# EAGLE design Mircrocontroller-test-moudle (EAGLE 8.6.0)
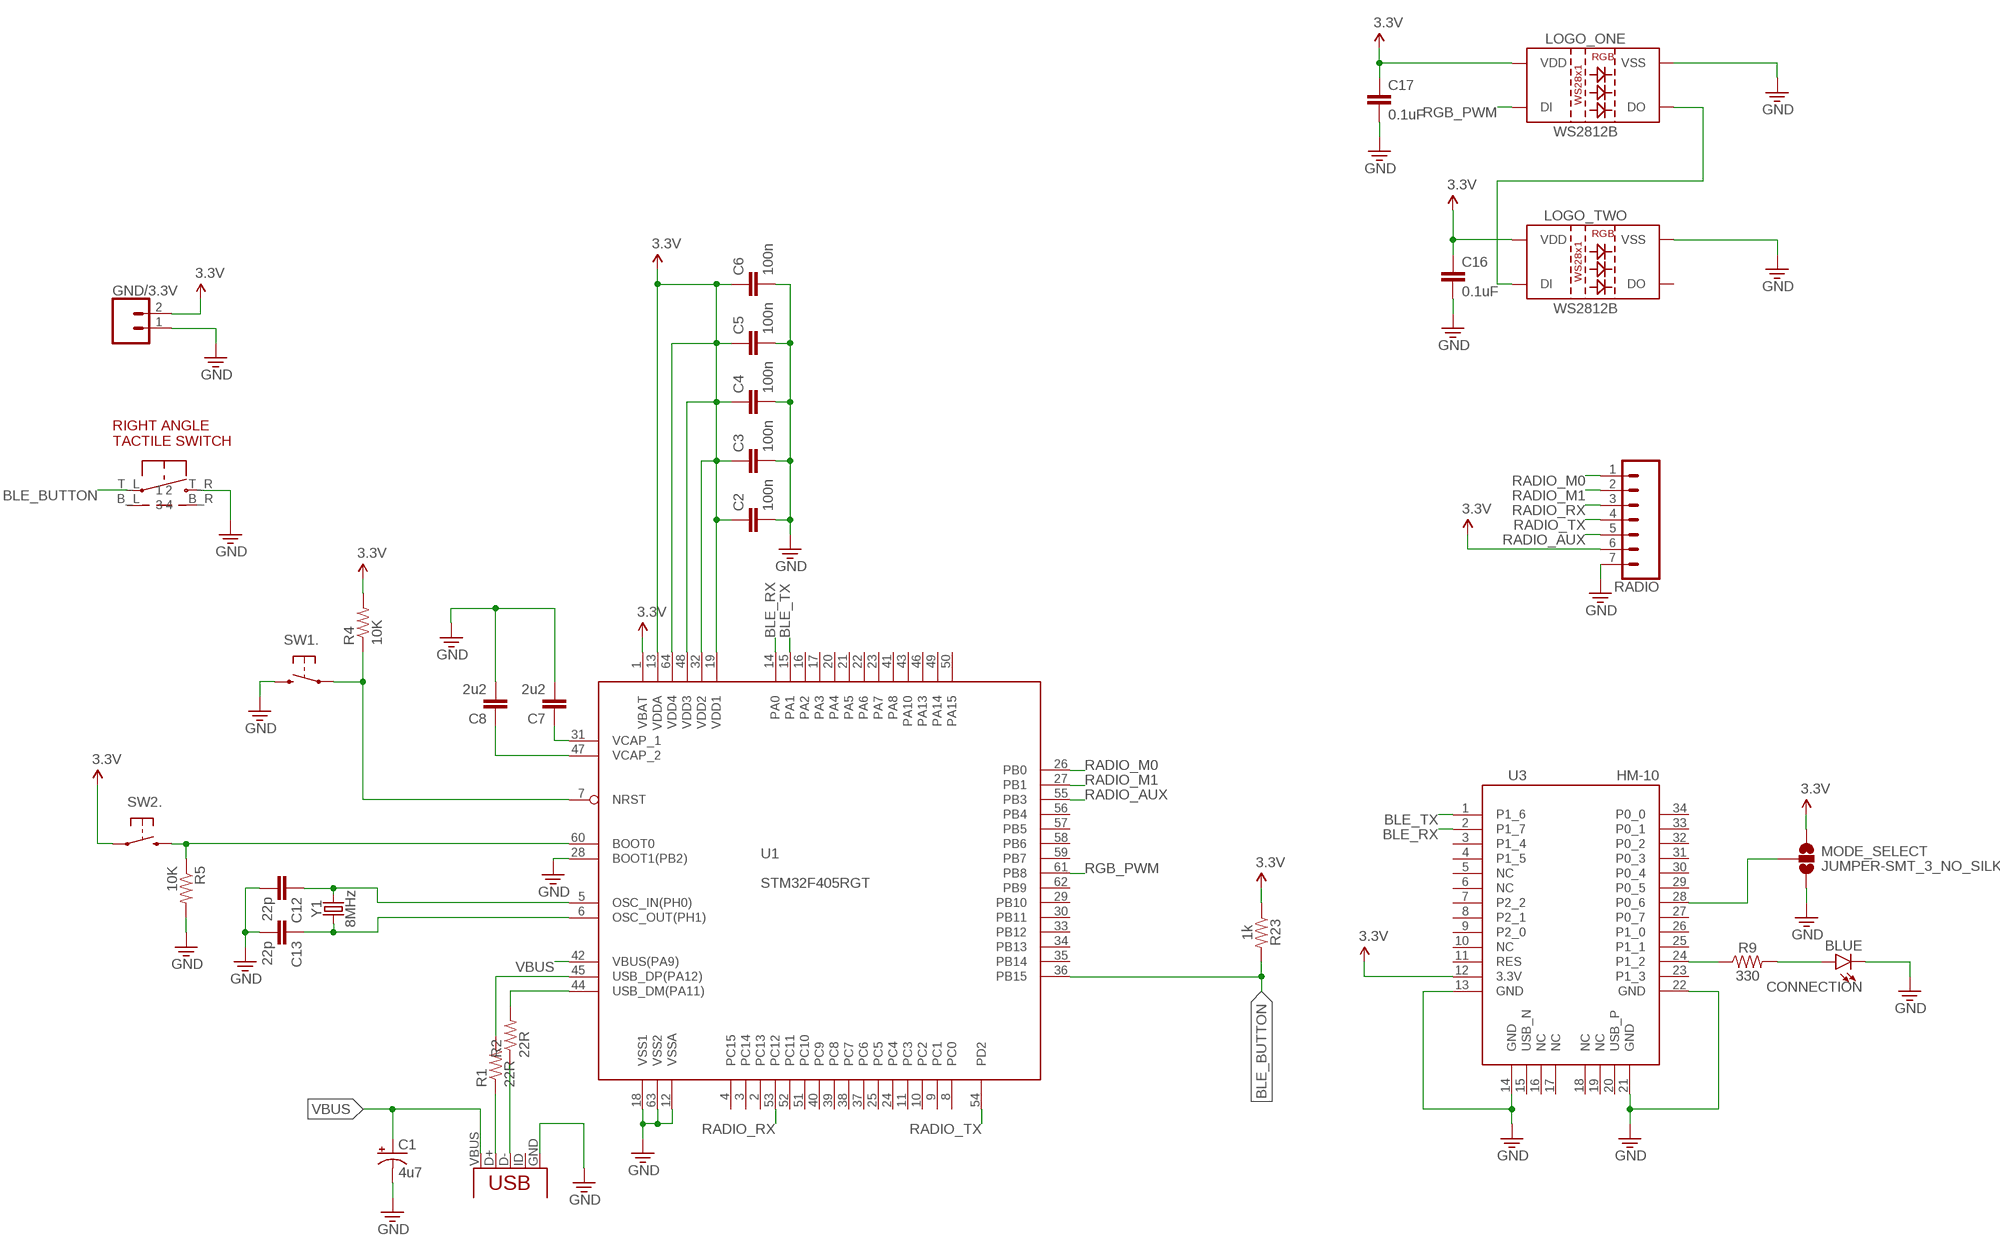
[diagram p0: schematic, sheet 1]

## Parts
C1  4u7  CAP_POL1206-KIT  [EIA3216-KIT]
C2  100n  CAP0603-CAP  [0603-CAP]
C3  100n  CAP0603-CAP  [0603-CAP]
C4  100n  CAP0603-CAP  [0603-CAP]
C5  100n  CAP0603-CAP  [0603-CAP]
C6  100n  CAP0603-CAP  [0603-CAP]
C7  2u2  CAP0603-CAP  [0603-CAP]
C8  2u2  CAP0603-CAP  [0603-CAP]
C12  22p  CAP0603-CAP  [0603-CAP]
C13  22p  CAP0603-CAP  [0603-CAP]
C16  0.1uF  0.1UF-0603-25V-5%  [0603]
C17  0.1uF  0.1UF-0603-25V-5%  [0603]
CONNECTION  BLUE  LED-BLUE0603  [LED-0603]
GND/3.3V  CONN_02LOCK  [1X02_LOCK]
LOGO_ONE  WS2812B  [WS2812B]
LOGO_TWO  WS2812B  [WS2812B]
MODE_SELECT  JUMPER-SMT_3_NO_SILK  [SMT-JUMPER_3_NO_SILK]
R1  22R  RESISTOR0603-RES  [0603-RES]
R2  22R  RESISTOR0603-RES  [0603-RES]
R4  10K  RESISTOR0603-RES  [0603-RES]
R5  10K  RESISTOR0603-RES  [0603-RES]
R9  330  330OHM-0603-1/10W-1%  [0603]
R23  1k  1KOHM-0603-1/10W-1%  [0603]
RADIO  CONN_07  [1X07]
SW1  !RST  SWITCH-B3U-1110-BOSS  [SWITCH-TACT-B3U-1100P-B]
SW2  BOOT  SWITCH-B3U-1110-BOSS  [SWITCH-TACT-B3U-1100P-B]
U1  STM32F405RGT  [LQFP64]
U3  HM-10  [HM-10]
U$1  RIGHT_ANGLE_TACTILE_SWITCH  [RIGHT_ANGLE_TACTILE_SWITCH]
USB  USB-MICROB-SMD  [USB-MICROB-SMD]
Y1  8MHz  CRYSTAL-8MHZSMD-5X3.2  [CRYSTAL-SMD-5X3.2-4PAD]

## Nets
3.3V: C2.1 C3.1 C4.1 C5.1 C6.1 C16.1 C17.1 GND/3.3V.2 LOGO_ONE.1(VDD) LOGO_TWO.1(VDD) MODE_SELECT.1 R4.2 R23.1 RADIO.6 SW2.1 U1.1(VBAT) U1.13(VDDA) U1.19(VDD1) U1.32(VDD2) U1.48(VDD3) U1.64(VDD4) U3.12(3.3V)
BLE_BUTTON: R23.2 U1.36(PB15) U$1.T_L
BLE_RX [Signal]: U1.14(PA0) U3.2(P1_7)
BLE_TX [Signal]: U1.15(PA1) U3.1(P1_6)
GND: C1.C(-) C2.2 C3.2 C4.2 C5.2 C6.2 C7.2 C8.2 C12.2 C13.2 C16.2 C17.2 CONNECTION.C GND/3.3V.1 LOGO_ONE.3(VSS) LOGO_TWO.3(VSS) MODE_SELECT.3 R5.2 RADIO.7 SW1.2 U1.12(VSSA) U1.18(VSS1) U1.28(BOOT1(PB2)) U1.63(VSS2) U3.13(GND) U3.14(GND) U3.21(GND) U3.22(GND) U$1.T_R USB.GND
N$1: R1.2 U1.45(USB_DP(PA12))
N$2: R2.2 U1.44(USB_DM(PA11))
N$5: R1.1 USB.D+
N$6: R2.1 USB.D-
N$7: CONNECTION.A R9.2
N$9: R9.1 U3.24(P1_2)
N$10: MODE_SELECT.2 U3.28(P0_6)
N$11: LOGO_ONE.2(DO) LOGO_TWO.4(DI)
N$12: C13.1 U1.6(OSC_OUT(PH1)) Y1.1
N$13: C7.1 U1.31(VCAP_1)
N$14: C8.1 U1.47(VCAP_2)
N$15: C12.1 U1.5(OSC_IN(PH0)) Y1.3
N$16 [Signal]: R5.1 SW2.2 U1.60(BOOT0)
N$17 [Signal]: R4.1 SW1.1 U1.7(NRST)
RADIO_AUX: RADIO.5 U1.55(PB3)
RADIO_M0: RADIO.1 U1.26(PB0)
RADIO_M1: RADIO.2 U1.27(PB1)
RADIO_RX: RADIO.3 U1.53(PC12)
RADIO_TX: RADIO.4 U1.54(PD2)
RGB_PWM [Signal]: LOGO_ONE.4(DI) U1.61(PB8)
VBUS: C1.A(+) U1.42(VBUS(PA9)) USB.VBUS
Unconnected: LOGO_TWO.2(DO) SW1.BOSS SW2.BOSS U1.2(PC13) U1.3(PC14) U1.4(PC15) U1.8(PC0) U1.9(PC1) U1.10(PC2) U1.11(PC3) U1.16(PA2) U1.17(PA3) U1.20(PA4) U1.21(PA5) U1.22(PA6) U1.23(PA7) U1.24(PC4) U1.25(PC5) U1.29(PB10) U1.30(PB11) U1.33(PB12) U1.34(PB13) U1.35(PB14) U1.37(PC6) U1.38(PC7) U1.39(PC8) U1.40(PC9) U1.41(PA8) U1.43(PA10) U1.46(PA13) U1.49(PA14) U1.50(PA15) U1.51(PC10) U1.52(PC11) U1.56(PB4) U1.57(PB5) U1.58(PB6) U1.59(PB7) U1.62(PB9) U3.3(P1_4) U3.4(P1_5) U3.5(NC) U3.6(NC) U3.7(P2_2) U3.8(P2_1) U3.9(P2_0) U3.10(NC) U3.11(RES) U3.15(USB_N) U3.16(NC) U3.17(NC) U3.18(NC) U3.19(NC) U3.20(USB_P) U3.23(P1_3) U3.25(P1_1) U3.26(P1_0) U3.27(P0_7) U3.29(P0_5) U3.30(P0_4) U3.31(P0_3) U3.32(P0_2) U3.33(P0_1) U3.34(P0_0) U$1.B_L U$1.B_R USB.ID USB.MT1 USB.MT2 USB.MT3 USB.MT4

## Library data of the parts
C1 = stm32f4stamp:CAP_POL: Capacitor Polarized These are standard SMD and PTH capacitors. Normally 10uF, 47uF, and 100uF in electrolytic and tantalum varieties. Always verify the external diameter of the through hole cap, it varies with capacity, voltage, and manufacturer. The EIA devices should be standard.; OC_NEWARK: unknown
C2-C8 C12 C13 = stm32f4stamp:CAP: Capacitor Standard 0603 ceramic capacitor, and 0.1" leaded capacitor.; OC_NEWARK: unknown
C16 C17 = SparkFun-Capacitors:0.1UF: 0.1µF ceramic capacitors A capacitor is a passive two-terminal electrical component used to store electrical energy temporarily in an electric field.; OC_NEWARK: unknown; PROD_ID: CAP-08604
CONNECTION = SparkFun-LED:LED-BLUE: Blue SMD LED Used in manufacturing of various products at SparkFun Packages: 0603 - SMD 0603 package [Product Link] <http://www.digikey.com/product-detail/en/SMLE12BC7TT86/511-1589-2-ND/1641808> 1206 - SMD1206 package [Product Link] <http://www.digikey.com/product-detail/en/lite-on-inc/LTST-C150TBKT/160-1643-1-ND/573584> SparkFun Products: ESP8266 Thing-Dev Board <https://www.sparkfun.com/products/13711> RedBoard <https://www.sparkfun.com/products/12757>; OC_NEWARK: unknown; PROD_ID: DIO-08575
GND/3.3V = SparkFun-Connectors:CONN_02: Multi connection point. Often used as Generic Header-pin footprint for 0.1 inch spaced/style header connections On any of the 0.1 inch spaced packages, you can populate with these: Break Away Headers - Straight <https://www.sparkfun.com/products/116> (PRT-00116) Break Away Male Headers - Right Angle <https://www.sparkfun.com/products/553> (PRT-00553) Female Headers <https://www.sparkfun.com/products/115> (PRT-00115) Break Away Headers - Machine Pin <https://www.sparkfun.com/products/117> (PRT-00117) Break Away Female Headers - Swiss Machine Pin <https://www.sparkfun.com/products/743> (PRT-00743) For SCREWTERMINALS and SPRING TERMINALS visit here: Screw Terimnals on SparkFun.com <https://www.sparkfun.com/search/results?term=Screw+Terminals> (5mm/3.5mm/2.54mm spacing) This device is also useful as a general connection point to wire up your design to another part of your project. Our various solder wires solder well into these plated through hole pads. Hook-Up Wire - Assortment (Stranded, 22 AWG) <https://www.sparkfun.com/products/11375> (PRT-11375) Hook-Up Wire - Assortment (Solid Core, 22 AWG) <https://www.sparkfun.com/products/11367> (PRT-11367) View the entire wire category on our website here <https://www.sparkfun.com/categories/141> Special notes: Molex polarized connector foot print use with: PRT-08233 with associated crimp pins and housings. 2.54_SCREWTERM for use with PRT-10571. 3.5mm Screw Terminal footprints for PRT-08084 5mm Screw Terminal footprints for use with PRT-08432
LOGO_ONE LOGO_TWO = SparkFun-LED:WS2812B: WS2812B SMD addressable RGB LED 5x5mm SMD LED with built-in controller IC. Color: Red/Green/Blue mC Rating: RGB: 390, 660, 180 mcd Forward Voltage: RGB: 2.0, 3.0, 3.0 V Packages:WS2812B SparkFun Products: Blynk Board - ESP8266 <https://www.sparkfun.com/products/13794>; OC_NEWARK: unknown; PROD_ID: DIO-12503
MODE_SELECT = SparkFun-Jumpers:JUMPER-SMT_3_NO: Normally open jumper This jumper has three pads in close proximity to each other. Apply solder to close the connection(s).; OC_NEWARK: unknown
R1 R2 R4 R5 = stm32f4stamp:RESISTOR: Resistor Basic schematic elements and footprints for 0603, 1206, and PTH resistors.; OC_NEWARK: unknown
R9 = SparkFun-Resistors:330OHM: 330Ω resistor A resistor is a passive two-terminal electrical component that implements electrical resistance as a circuit element. Resistors act to reduce current flow, and, at the same time, act to lower voltage levels within circuits. - Wikipedia; OC_NEWARK: unknown; PROD_ID: RES-00818
R23 = SparkFun-Resistors:1KOHM: 1kΩ resistor A resistor is a passive two-terminal electrical component that implements electrical resistance as a circuit element. Resistors act to reduce current flow, and, at the same time, act to lower voltage levels within circuits. - Wikipedia; OC_NEWARK: unknown; PROD_ID: RES-07856
RADIO = SparkFun-Connectors:CONN_07: Multi connection point. Often used as Generic Header-pin footprint for 0.1 inch spaced/style header connections On any of the 0.1 inch spaced packages, you can populate with these: Break Away Headers - Straight <https://www.sparkfun.com/products/116> (PRT-00116) Break Away Male Headers - Right Angle <https://www.sparkfun.com/products/553> (PRT-00553) Female Headers <https://www.sparkfun.com/products/115> (PRT-00115) Break Away Headers - Machine Pin <https://www.sparkfun.com/products/117> (PRT-00117) Break Away Female Headers - Swiss Machine Pin <https://www.sparkfun.com/products/743> (PRT-00743) For SCREWTERMINALS and SPRING TERMINALS visit here: Screw Terimnals on SparkFun.com <https://www.sparkfun.com/search/results?term=Screw+Terminals> (5mm/3.5mm/2.54mm spacing) This device is also useful as a general connection point to wire up your design to another part of your project. Our various solder wires solder well into these plated through hole pads. Hook-Up Wire - Assortment (Stranded, 22 AWG) <https://www.sparkfun.com/products/11375> (PRT-11375) Hook-Up Wire - Assortment (Solid Core, 22 AWG) <https://www.sparkfun.com/products/11367> (PRT-11367) View the entire wire category on our website here <https://www.sparkfun.com/categories/141> Special notes: Molex polarized connector foot print use with SKU : PRT-08231 with associated crimp pins and housings. 1MM SMD Version SKU: PRT-10208 NOTES ON THE VARIANTS LOCK and LOCK_LONGPADS... This footprint was designed to help hold the alignment of a through-hole component (i.e. 6-pin header) while soldering it into place. You may notice that each hole has been shifted either up or down by 0.005 of an inch from it's more standard position (which is a perfectly straight line). This slight alteration caused the pins (the squares in the middle) to touch the edges of the holes. Because they are alternating, it causes a "brace" to hold the component in place. 0.005 has proven to be the perfect amount of "off-center" position when using our standard breakaway headers. Although looks a little odd when you look at the bare footprint, once you have a header in there, the alteration is very hard to notice. Also,if you push a header all the way into place, it is covered up entirely on the bottom side.
SW1 SW2 = stm32f4stamp:SWITCH-B3U-1110; OC_NEWARK: unknown
U1 = stm32f4stamp:STM32F405RGT; OC_NEWARK: unknown
U3 = HM-10:HM-10; OC_NEWARK: unknown
U$1 = KevinMade:RIGHT_ANGLE_TACTILE_SWITCH; OC_NEWARK: unknown
USB = stm32f4stamp:USB: USB Connectors USB-B-PTH is fully proven SKU : PRT-00139 USB-miniB is fully proven SKU : PRT-00587 USB-A-PCB is untested. USB-A-H is throughly reviewed, but untested. Spark Fun Electronics SKU : PRT-00437 USB-B-SMT is throughly reviewed, but untested. Needs silkscreen touching up. USB-A-S has not been used/tested USB-MB-H has not been used/tested; OC_NEWARK: unknown
Y1 = SparkFun-Clocks:CRYSTAL-8MHZ: 8MHz Crystal Datasheet Example <http://www.futureelectronics.com/en/technologies/electromechanical/timing-devices/crystals/Pages/6008189-ABM3B-8.000MHZ-B2-T.aspx?IM=0> Frequency: 8MHz Frequency Tolerance: ±20ppm Load Capacitance: 18pF SparkFun Products: Pro Micro -3.3V/8MHz <https://www.sparkfun.com/products/12587> WAV Trigger <https://www.sparkfun.com/products/13660>; OC_NEWARK: unknown; PROD_ID: XTAL-09431

## Net classes
0 default: width 0.254 mm, drill 0.305 mm, clearance 0.152 mm
1 Radio: width 0.762 mm, drill 0.762 mm, clearance 0.254 mm
3 Signal: width 0.152 mm, drill 0.305 mm, clearance 0.152 mm

## Board
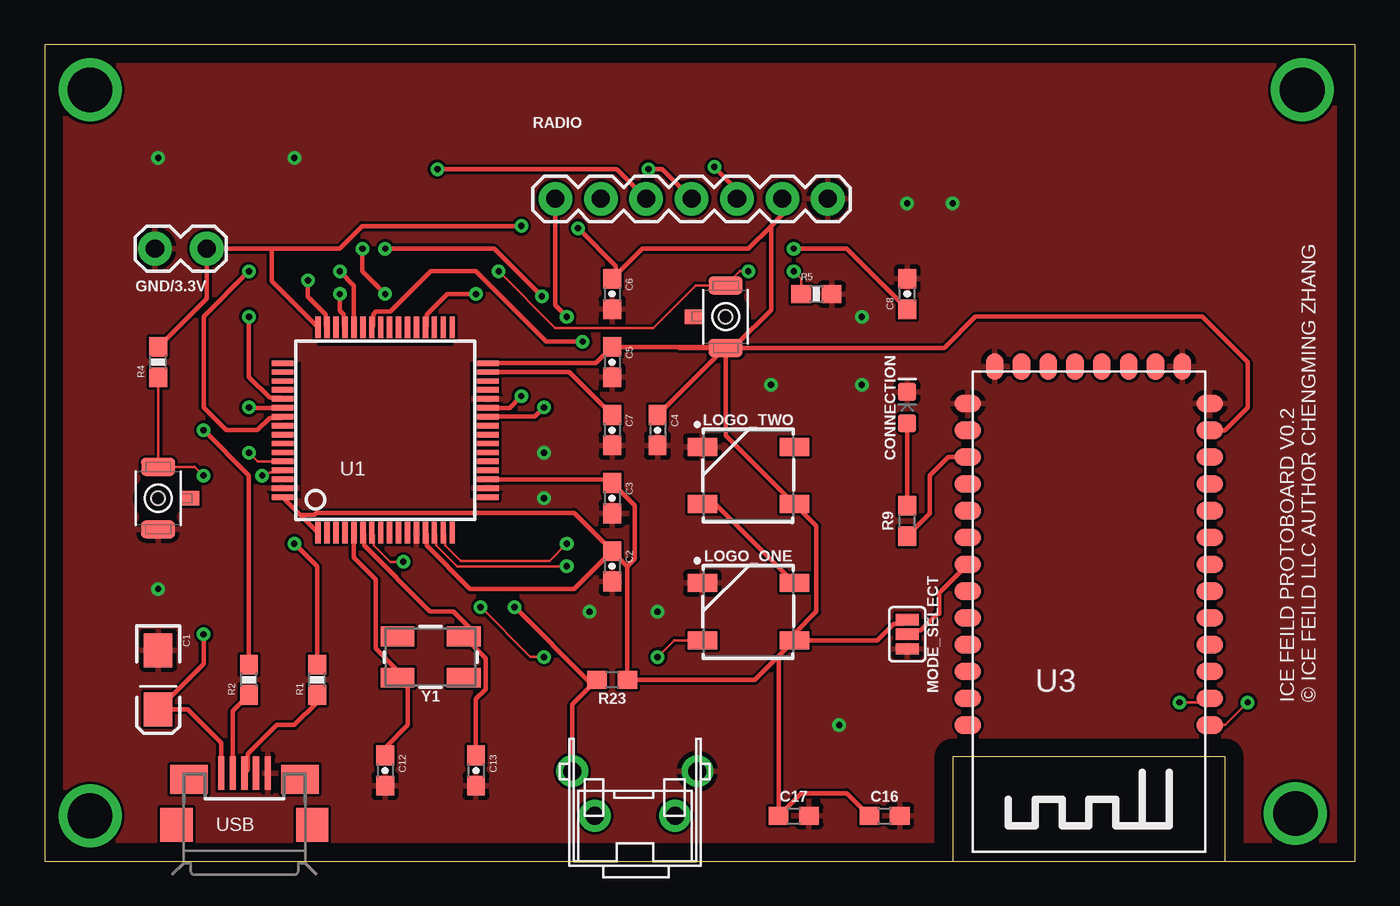
[diagram p1: board, top side]
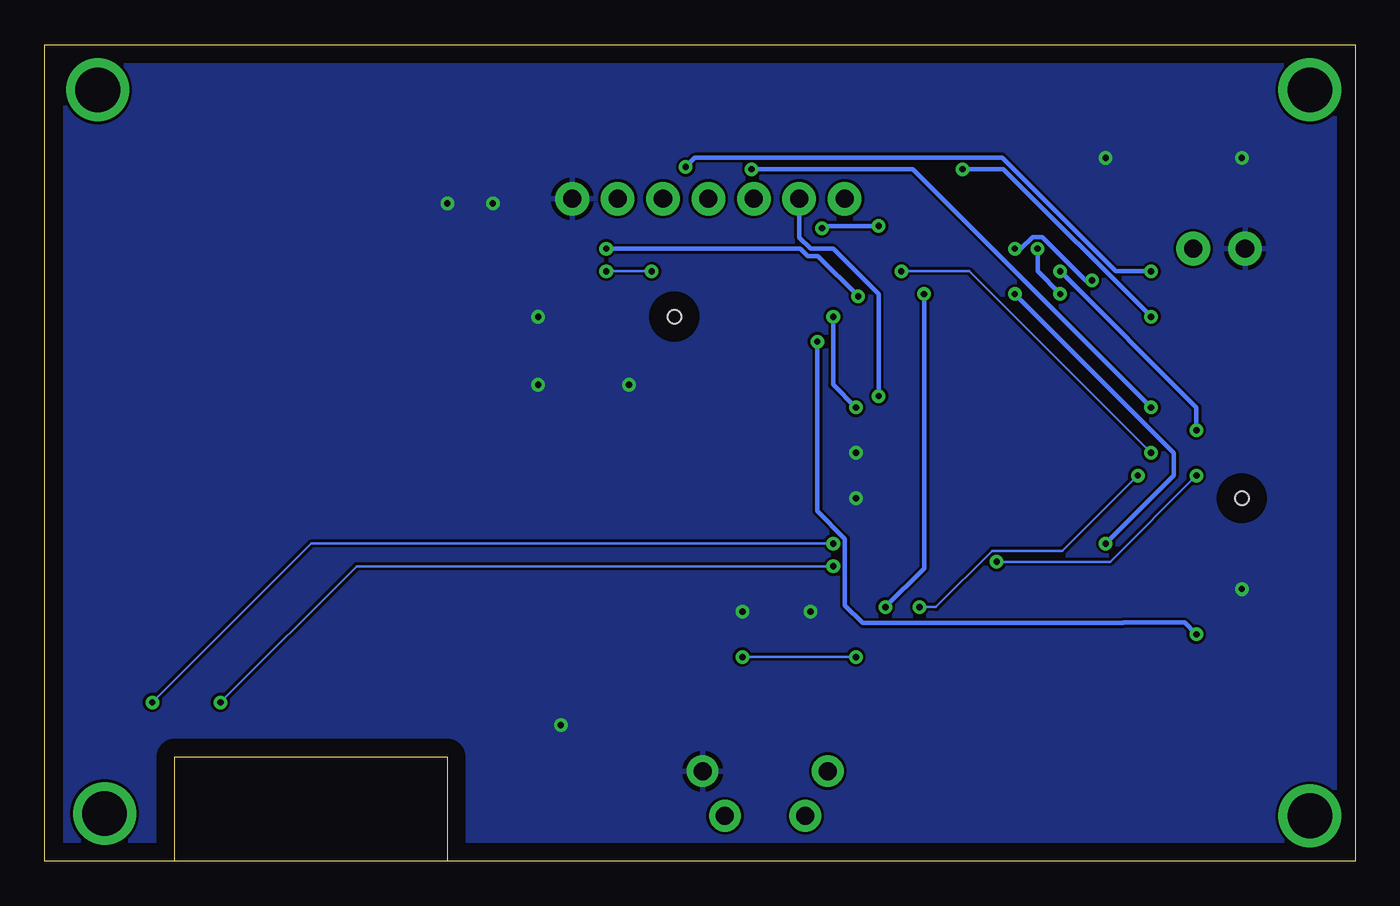
[diagram p2: board, bottom side, seen from below]

Size 73.33 x 45.71 mm. Coordinates in mm from the lower left corner, seen from the top.
Outline: 0,0 73.33,0 73.33,45.71 0,45.71 0,0
Copper layers (1*16): Top 0.035mm / dielectric 1.5mm / Bottom 0.035mm
Design rules "default": minimum track width 6mil, minimum drill 0.35mm, track to track 6mil, track to pad 6mil, pad to pad 6mil, via to via 6mil, smd to smd 6mil, copper to edge 40mil, drill to drill 6mil, minimum pad ring 10mil, minimum via ring 8mil, stop-mask expansion 4mil, vias tented up to drill 0mil, thermal gap 10mil

### Footprints (pad centres in the part's own frame; a part is rotated, then mirrored left to right if it is on the bottom)
EIA3216-KIT = smd 1.9 x 1.6: A 1.65,0; C -1.65,0
0603-CAP = smd 1.1 x 1: 1 -0.85,0; 2 0.85,0
0603 = smd 1.1 x 1: 1 -0.85,0; 2 0.85,0
LED-0603 = smd 1 x 1: A -0.877,0; C 0.877,0
1X02_LOCK = drill 1.016 pad 1.88: 1 -0.178,0; 2 2.718,0
WS2812B = smd 1.651 x 1: 1 2.577,-1.6; 2 2.577,1.6; 3 -2.577,1.6; 4 -2.577,-1.6
SMT-JUMPER_3_NO_SILK = smd 0.635 x 1.27: 1 -0.813,0; 2 0,0; 3 0.813,0
0603-RES = smd 1.1 x 1: 1 -0.85,0; 2 0.85,0
1X07 = drill 1.016 pad 1.88: 1 0,0; 2 2.54,0; 3 5.08,0; 4 7.62,0; 5 10.16,0; 6 12.7,0; 7 15.24,0
SWITCH-TACT-B3U-1100P-B = smd 1 x 1.9: 1 -1.75,0; 2 1.75,0 | smd 0.8 x 1.1: BOSS 0,1.75 | hole 0.762: 0,0
LQFP64 = smd 0.3 x 1.2: 1 -3.75,-5.75; 2 -3.25,-5.75; 3 -2.75,-5.75; 4 -2.25,-5.75; 5 -1.75,-5.75; 6 -1.25,-5.75; 7 -0.75,-5.75; 8 -0.25,-5.75; 9 0.25,-5.75; 10 0.75,-5.75; 11 1.25,-5.75; 12 1.75,-5.75; 13 2.25,-5.75; 14 2.75,-5.75; 15 3.25,-5.75; 16 3.75,-5.75; 33 3.75,5.75; 34 3.25,5.75; 35 2.75,5.75; 36 2.25,5.75; 37 1.75,5.75; 38 1.25,5.75; 39 0.75,5.75; 40 0.25,5.75; 41 -0.25,5.75; 42 -0.75,5.75; 43 -1.25,5.75; 44 -1.75,5.75; 45 -2.25,5.75; 46 -2.75,5.75; 47 -3.25,5.75; 48 -3.75,5.75 | smd 1.2 x 0.3: 17 5.75,-3.75; 18 5.75,-3.25; 19 5.75,-2.75; 20 5.75,-2.25; 21 5.75,-1.75; 22 5.75,-1.25; 23 5.75,-0.75; 24 5.75,-0.25; 25 5.75,0.25; 26 5.75,0.75; 27 5.75,1.25; 28 5.75,1.75; 29 5.75,2.25; 30 5.75,2.75; 31 5.75,3.25; 32 5.75,3.75; 49 -5.75,3.75; 50 -5.75,3.25; 51 -5.75,2.75; 52 -5.75,2.25; 53 -5.75,1.75; 54 -5.75,1.25; 55 -5.75,0.75; 56 -5.75,0.25; 57 -5.75,-0.25; 58 -5.75,-0.75; 59 -5.75,-1.25; 60 -5.75,-1.75; 61 -5.75,-2.25; 62 -5.75,-2.75; 63 -5.75,-3.25; 64 -5.75,-3.75
HM-10 = smd 1.5 x 1: 1 -6.77,6.35; 2 -6.77,4.85; 3 -6.77,3.35; 4 -6.77,1.85; 5 -6.77,0.35; 6 -6.77,-1.15; 7 -6.77,-2.65; 8 -6.77,-4.15; 9 -6.77,-5.65; 10 -6.77,-7.15; 11 -6.77,-8.65; 12 -6.77,-10.15; 13 -6.77,-11.65; 22 6.77,-11.65; 23 6.77,-10.15; 24 6.77,-8.65; 25 6.77,-7.15; 26 6.77,-5.65; 27 6.77,-4.15; 28 6.77,-2.65; 29 6.77,-1.15; 30 6.77,0.35; 31 6.77,1.85; 32 6.77,3.35; 33 6.77,4.85; 34 6.77,6.35 | smd 1 x 1.5: 14 -5.23,-13.72; 15 -3.73,-13.72; 16 -2.23,-13.72; 17 -0.73,-13.72; 18 0.77,-13.72; 19 2.27,-13.72; 20 3.77,-13.72; 21 5.27,-13.72
RIGHT_ANGLE_TACTILE_SWITCH = drill 1 pad 1.778: B_L -2.25,0; B_R 2.25,0; T_L -3.5,2.5; T_R 3.5,2.5
USB-MICROB-SMD = smd 0.35 x 1.9: D+ 0,2.9; D- -0.65,2.9; GND 1.3,2.9; ID 0.65,2.9; VBUS -1.3,2.9 | smd 1.8 x 1.9: MT1 -3.8,0; MT2 3.8,0 | smd 2.1 x 1.6: MT3 -3.1,2.55; MT4 3.1,2.55
CRYSTAL-SMD-5X3.2-4PAD = smd 1.9 x 1.1: 1 -1.85,-1.15; 2 1.85,-1.15; 3 1.85,1.15; 4 -1.85,1.15

### Placement (x,y rotation side)
C1  6.35,10.16 270 top
C2  31.75,16.51 270 top
C3  31.75,20.32 270 top
C4  34.29,24.13 270 top
C5  31.75,27.94 270 top
C6  31.75,31.75 270 top
C7  31.75,24.13 270 top
C8  48.26,31.75 90 top
C12  19.05,5.08 270 top
C13  24.13,5.08 270 top
C16  46.99,2.54 0 top
C17  41.91,2.54 0 top
CONNECTION  48.26,25.4 90 top
GND/3.3V  6.35,34.29 0 top
LOGO_ONE  39.37,13.97 0 top
LOGO_TWO  39.37,21.59 0 top
MODE_SELECT  48.26,12.7 270 top
R1  15.24,10.16 90 top
R2  11.43,10.16 90 top
R4  6.35,27.94 90 top
R5  43.18,31.75 0 top
R9  48.26,19.05 90 top
R23  31.75,10.16 180 top
RADIO  28.57,37.08 0 top
SW1  6.35,20.32 270 top
SW2  38.1,30.48 90 top
U1  19.05,24.13 0 top
U3  58.42,13.97 180 top
U$1  33.02,2.54 0 top
USB  11.18,2.03 0 top
Y1  21.59,11.43 180 top

### Tracks (layer width: path | path; a pad name or v marks a point on that pad's centre or on a via)
3.3V  (via drill 0.35)
  Top 0.254: R4.2 9.07,31.51 GND/3.3V.2 12.7,34.29 | 32.6,16.51 R23.1 39.74,10.16 LOGO_ONE.1 | 32.6,16.51 C2.1 | LOGO_ONE.1 41.06,11.48 C17.1 42.33,3.81 44.87,3.81 C16.1 | MODE_SELECT.1 48.04,13.3 47.51,13.3 46.58,12.37 LOGO_ONE.1 | U1.19 31.54,21.38 C3.1 33.02,19.9 33.02,16.93 32.6,16.51 | U1.32 30.84,27.88 C5.1 38.04,28.79 | 35.5,28.73 SW2.1 | 38.04,28.79 SW2.1 | LOGO_ONE.1 41.95,12.74 43.18,13.97 43.18,18.76 LOGO_TWO.1 38.1,23.84 SW2.1 | SW2.1 50.32,28.73 52.07,30.48 64.77,30.48 67.31,27.94 67.31,25.4 66.03,24.12 U3.12 | 38.04,28.79 38.21,28.96 38.73,28.96 40.64,30.86 40.64,35.56 | C6.1 31.96,32.81 | 31.96,32.81 33.44,34.29 39.37,34.29 40.64,35.56 | U1.13 21.37,18.31 21.37,17.66 23.8,15.24 29.63,15.24 C2.1 | U1.64 14.3,19.38 | 14.3,19.38 U1.1 | 14.3,19.38 15.07,19.38 15.19,19.49 29.62,19.49 C2.1 | 12.7,34.29 16.51,34.29 17.78,35.56 v26.67,35.56 | v29.84,35.43 31.96,33.32 31.96,32.81 | U1.48 12.7,32.48 12.7,34.29 | C4.1 38.04,28.73 SW2.1 | 40.64,35.56 41.27,36.2 RADIO.6
  Bottom 0.254: v29.84,35.43 29.72,35.56 v26.67,35.56
BLE_BUTTON  (via drill 0.35)
  Top 0.254: U$1.T_L 29.52,8.78 30.69,9.95 | 30.69,9.95 R23.2 | U1.36 21.37,29.95 21.37,30.6 22.52,31.75 v24.13,31.75 | v26.29,14.22 30.56,9.95 30.69,9.95
  Bottom 0.254: v24.13,31.75 24.13,16.38 v26.29,14.22
BLE_RX  (via drill 0.35)
  Top 0.152: U1.14 21.92,18.26 21.92,17.68 23.1,16.51 v29.21,16.51 | v63.5,8.89 64.96,8.89 U3.2
  Bottom 0.152: v29.21,16.51 55.88,16.51 v63.5,8.89
BLE_TX  (via drill 0.35)
  Top 0.152: U1.15 22.42,18.26 22.42,17.68 23.29,16.82 28.25,16.82 v29.21,17.78 | v67.31,8.89 66.04,7.62 U3.1
  Bottom 0.152: v29.21,17.78 58.42,17.78 v67.31,8.89
GND  (via drill 0.35)
  other vias: 30.48,13.97 34.29,13.97 27.94,22.86 27.94,20.32 45.72,30.48 45.72,26.67 40.64,26.67 6.35,15.24 6.35,39.37 13.97,39.37 44.45,7.62 50.8,36.83 48.26,36.83
  pour Bottom: 0,46.99 0,0 76.2,0 76.2,46.99
  pour Top: 0,46.99 0,0 76.2,0 76.2,46.99
N$1  (via drill 0.35)
  Top 0.254: R1.2 15.24,16.51 v13.97,17.78 | v19.05,31.75 17.78,33.02 v17.78,34.29 | U1.45 16.73,29.95 16.73,30.6 16.51,30.82 v16.51,31.75
  Bottom 0.254: v17.78,34.29 17.78,33.02 v16.51,31.75 | v13.97,17.78 10.16,21.59 10.16,22.86 v19.05,31.75
N$2  (via drill 0.35)
  Top 0.254: R2.2 11.43,21.59 v8.89,24.13 | v16.51,33.02 17.3,32.23 U1.44
  Bottom 0.254: v16.51,33.02 8.89,25.4 v8.89,24.13
N$3  (via drill 2.5)
  other vias: 2.54,43.18
N$4  (via drill 2.5)
  other vias: 2.54,2.54
N$5
  Top 0.254: USB.D+ 11.37,5.13 11.37,6 12.99,7.62 13.97,7.62 15.24,8.89 R1.1
N$6
  Top 0.254: USB.D- 10.53,8.41 R2.1
N$7
  Top 0.254: R9.2 CONNECTION.A
N$8  (via drill 2.5)
  other vias: 69.98,2.67
N$9
  Top 0.254: R9.1 49.53,19.47 49.53,21.59 50.56,22.62 U3.24
N$10
  Top 0.254: MODE_SELECT.2 48.48,12.92 49.01,12.92 49.94,13.84 50.04,13.84 50.04,15.01 U3.28
N$11
  Top 0.254: LOGO_TWO.4 37.53,19.99 LOGO_ONE.2
N$12
  Top 0.254: C13.1 24.13,9.07 24.67,9.61 24.67,11.35 23.73,12.29 | 23.73,12.29 Y1.1 | U1.6 17.87,18.31 17.87,17.66 21.52,14.01 21.55,14.01 21.59,13.97 22.86,13.97 23.73,13.11 23.73,12.29
N$13
  Top 0.254: U1.31 29.35,27.38 C7.1
N$14  (via drill 0.35)
  Top 0.254: C8.1 44.87,34.29 v41.91,34.29 | v27.81,31.62 25.15,34.29 v19.05,34.29 | U1.47 15.73,29.95 15.73,30.6 14.73,31.59 v14.73,32.51
  Bottom 0.254: v41.91,34.29 31.05,34.29 30.65,33.88 30.07,33.88 v27.81,31.62 | v14.73,32.51 15.07,32.51 17.51,34.95 18.05,34.95 18.71,34.29 v19.05,34.29
N$15
  Top 0.254: U1.5 17.3,16.99 18.51,15.78 18.51,11.91 19.74,10.69 Y1.3 20.32,9.7 20.32,7.62 19.05,6.35 C12.1
N$16  (via drill 0.35)
  Top 0.152: v39.37,33.02 38.89,33.02 SW2.2 36.42,32.23 34.04,29.84 28.57,29.84 v25.4,33.02 | v41.91,33.02 42.33,32.6 R5.1 | U1.60 11.91,22.38 v11.43,22.86
  Bottom 0.152: v39.37,33.02 v41.91,33.02 | v11.43,22.86 21.59,33.02 v25.4,33.02
N$17  (via drill 0.35)
  Top 0.152: R4.1 SW1.1 8.41,22.07 v8.89,21.59 | U1.7 18.42,18.26 18.42,17.68 19.34,16.76 v20.07,16.76
  Bottom 0.152: v8.89,21.59 13.72,16.76 v20.07,16.76
N$18  (via drill 2.5)
  other vias: 70.36,43.18
RADIO_AUX  (via drill 0.35)
  Top 0.254: U1.55 13.23,24.81 12.58,24.81 11.9,24.13 10.16,24.13 8.89,25.4 8.89,30.48 v11.43,33.02 | v37.47,38.86 38.73,37.59 RADIO.5
  Bottom 0.254: v11.43,33.02 13.39,33.02 19.77,39.39 34.05,39.39 34.08,39.37 36.96,39.37 v37.47,38.86
RADIO_M0  (via drill 0.35)
  Top 0.254: v29.21,30.48 28.57,31.12 RADIO.1 | v27.94,25.4 27.42,24.88 U1.26
  Bottom 0.254: v29.21,30.48 29.21,26.67 v27.94,25.4
RADIO_M1  (via drill 0.35)
  Top 0.254: U1.27 26.02,25.38 v26.67,26.04
  Bottom 0.254: v26.67,26.04 26.67,31.75 29.21,34.29 30.48,34.29 31.11,34.92 RADIO.2
RADIO_RX  (via drill 0.35)
  Top 0.254: U1.53 13.23,25.95 12.58,25.95 11.43,27.11 v11.43,30.48 | v21.97,38.73 32,38.73 RADIO.3
  Bottom 0.254: v11.43,30.48 19.68,38.73 v21.97,38.73
RADIO_TX  (via drill 0.35)
  Top 0.254: v33.78,38.73 34.54,38.73 RADIO.4 | v11.43,25.4 11.45,25.38 U1.54
  Bottom 0.254: v33.78,38.73 24.77,38.73 v11.43,25.4
RGB_PWM  (via drill 0.35)
  Top 0.152: U1.61 13.18,21.76 12.61,21.76 12.44,21.59 v12.17,21.59 | v24.38,14.22 27.18,11.43 v27.94,11.43 | v34.29,11.43 35.23,12.37 LOGO_ONE.4
  Bottom 0.152: v12.17,21.59 16.39,17.37 20.32,17.37 23.46,14.22 v24.38,14.22 | v27.94,11.43 v34.29,11.43
VBUS  (via drill 0.35)
  Top 0.254: USB.VBUS 9.88,6.63 8,8.51 C1.A 8.89,11.05 v8.89,12.7 | U1.42 18.37,29.95 18.37,30.6 18.53,30.76 19.05,30.76 19.18,30.76 19.33,30.76 21.59,33.02 24.13,33.02 28.07,29.08 v30.1,29.08
  Bottom 0.254: v30.1,29.08 30.1,19.6 28.55,18.05 28.55,14.33 27.56,13.34 12.99,13.34 12.97,13.36 9.55,13.36 v8.89,12.7

### Text on the board
tPlace: ICE FEILD PROTOBOARD V0.2 / © ICE FEILD LLC AUTHOR CHENGMING ZHANG